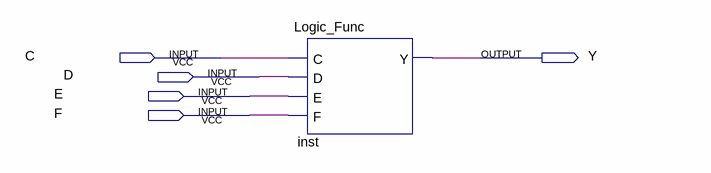
[diagram p0: schematic sheet]
// Quartus schematic Block2.bdf as structural Verilog: 1 symbols, 5 pins
module Block2 (
  input  C,
  input  D,
  input  E,
  input  F,
  output Y
);

  Logic_Func inst (.C(C), .D(D), .E(E), .F(F), .Y(Y));
endmodule
